# Altium schematic sheet half_bridge.SchDoc
size A
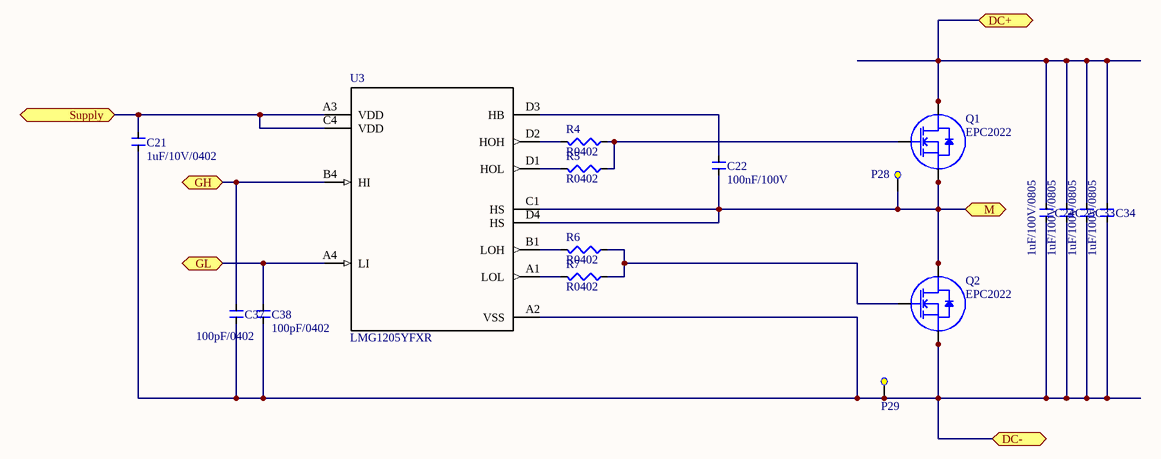
[diagram p0: half_bridge.SchDoc]

## Parts
C21  1uF/10V/0402/X5R/10%  [C0402_FOR_DRIVER]  (value not drawn)
C22  100nF/100V/0402/X5R/10%  [C0402_FOR_DRIVER]  (value not drawn)
C24  1uF/100V/20%/0805/X7S  [C0805]  (value not drawn)
C25  1uF/100V/20%/0805/X7S  [C0805]  (value not drawn)
C33  1uF/100V/20%/0805/X7S  [C0805]  (value not drawn)
C34  1uF/100V/20%/0805/X7S  [C0805]  (value not drawn)
C37  100pF/50V/5%/0402/C0G  [C0402_FOR_DRIVER]  (value not drawn)
C38  100pF/50V/5%/0402/C0G  [C0402_FOR_DRIVER]  (value not drawn)
P28  Test_Point_0.5mm  [Test_Point-0.5mm]  (value not drawn)
P29  Test_Point_0.5mm  [Test_Point-0.5mm]  (value not drawn)
Q1  EPC2022  [EPC2x40XL]
Q2  EPC2022  [EPC2x40XL]
R4  R0402  [R0402_FOR_DRIVER]
R5  R0402  [R0402_FOR_DRIVER]
R6  R0402  [R0402_FOR_DRIVER]
R7  R0402  [R0402_FOR_DRIVER]
U3  LMG1205YFXR  [YFX0012AHAP]

## Ports
DC+, DC-, GH, GL, M, Supply

## Nets
DC+: C24.2 C25.2 C33.2 C34.2 Q1.3(D1) Q1.4(D2) Q1.7(D3) Q1.8(D4) Q1.11(D5) Q1.12(D6) Q1.15(D7) Q1.16(D8) Q1.19(D9) Q1.20(D10) Q1.23(D11) Q1.24(D12) Q1.27(D13) Q1.28(D14) ; port DC+
DC-: C21.1 C24.1 C25.1 C33.1 C34.1 C37.1 C38.1 P29.1(Pri1+) Q2.2(S1) Q2.5(S2) Q2.6(S3) Q2.9(S4) Q2.10(S5) Q2.13(S6) Q2.14(S7) Q2.17(S8) Q2.18(S9) Q2.21(S10) Q2.22(S11) Q2.25(S12) Q2.26(S13) Q2.29(S14) Q2.30(Sub) U3.A2(VSS) ; port DC-
GH: C37.2 U3.B4(HI) ; port GH
GL: C38.2 U3.A4(LI) ; port GL
M: C22.1 P28.1(Pri1+) Q1.2(S1) Q1.5(S2) Q1.6(S3) Q1.9(S4) Q1.10(S5) Q1.13(S6) Q1.14(S7) Q1.17(S8) Q1.18(S9) Q1.21(S10) Q1.22(S11) Q1.25(S12) Q1.26(S13) Q1.29(S14) Q1.30(Sub) Q2.3(D1) Q2.4(D2) Q2.7(D3) Q2.8(D4) Q2.11(D5) Q2.12(D6) Q2.15(D7) Q2.16(D8) Q2.19(D9) Q2.20(D10) Q2.23(D11) Q2.24(D12) Q2.27(D13) Q2.28(D14) U3.C1(HS) U3.D4(HS) ; port M
Supply: C21.2 U3.A3(VDD) U3.C4(VDD) ; port Supply
NetC22_2: C22.2 U3.D3(HB)
NetQ1_1: Q1.1(G) R4.2 R5.2
NetQ2_1: Q2.1(G) R6.2 R7.2
NetR4_1: R4.1 U3.D2(HOH)
NetR5_1: R5.1 U3.D1(HOL)
NetR6_1: R6.1 U3.B1(LOH)
NetR7_1: R7.1 U3.A1(LOL)

## Notes on the sheet
- (in symbol 1uF/10V/0402/X5R/10%) 1uF/10V/0402
- (in symbol 1uF/100V/20%/0805/X7S) 1uF/100V/0805
- (in symbol 100nF/100V/0402/X5R/10%) 100nF/100V
- (in symbol 100pF/50V/5%/0402/C0G) 100pF/0402

## Library data of the parts
C21 = 1uF/10V/0402/X5R/10%: 311-1439-1-ND
C22 = 100nF/100V/0402/X5R/10%: GRM155R62A104KE14D
C24 C25 C33 C34 = 1uF/100V/20%/0805/X7S: 445-5206-1-ND
C37 C38 = 100pF/50V/5%/0402/C0G: 311-1024-1-ND
Q1 Q2 = EPC2022: 100V 60A 3.2mE; PCBfootprint: eGaNPAK; MFG: EPC; Config: *; Supplier 1: Digi-Key; Supplier 2: Digi-Key; Supplier 3: Digi-Key; Supplier Part Number 1: 917-1133-2-ND; Supplier Part Number 2: 917-1133-1-ND; Supplier Part Number 3: 917-1133-6-ND; Value: 100V 60A 3.2mE; MFGPN: EPC2022
R4-R7 = R0402: Resistor
U3 = LMG1205YFXR: No Description Available; Manufacturer: Texas Instruments; PartNumber: LMG1205YFXR; RefDes: RefDes; Type: DEV; Value: Value; Copyright: Copyright (C) 2018 Accelerated Designs. All rights reserved